# Altium schematic sheet STM32_IO.SchDoc: STM32 IO
size A3; CompanyName: Green Team Twente; Organization: Green Team Twente; Revision: V1.1; SheetNumber: 4; SheetTotal: 10; Team: 2024; Subsystem: Embedded Systems
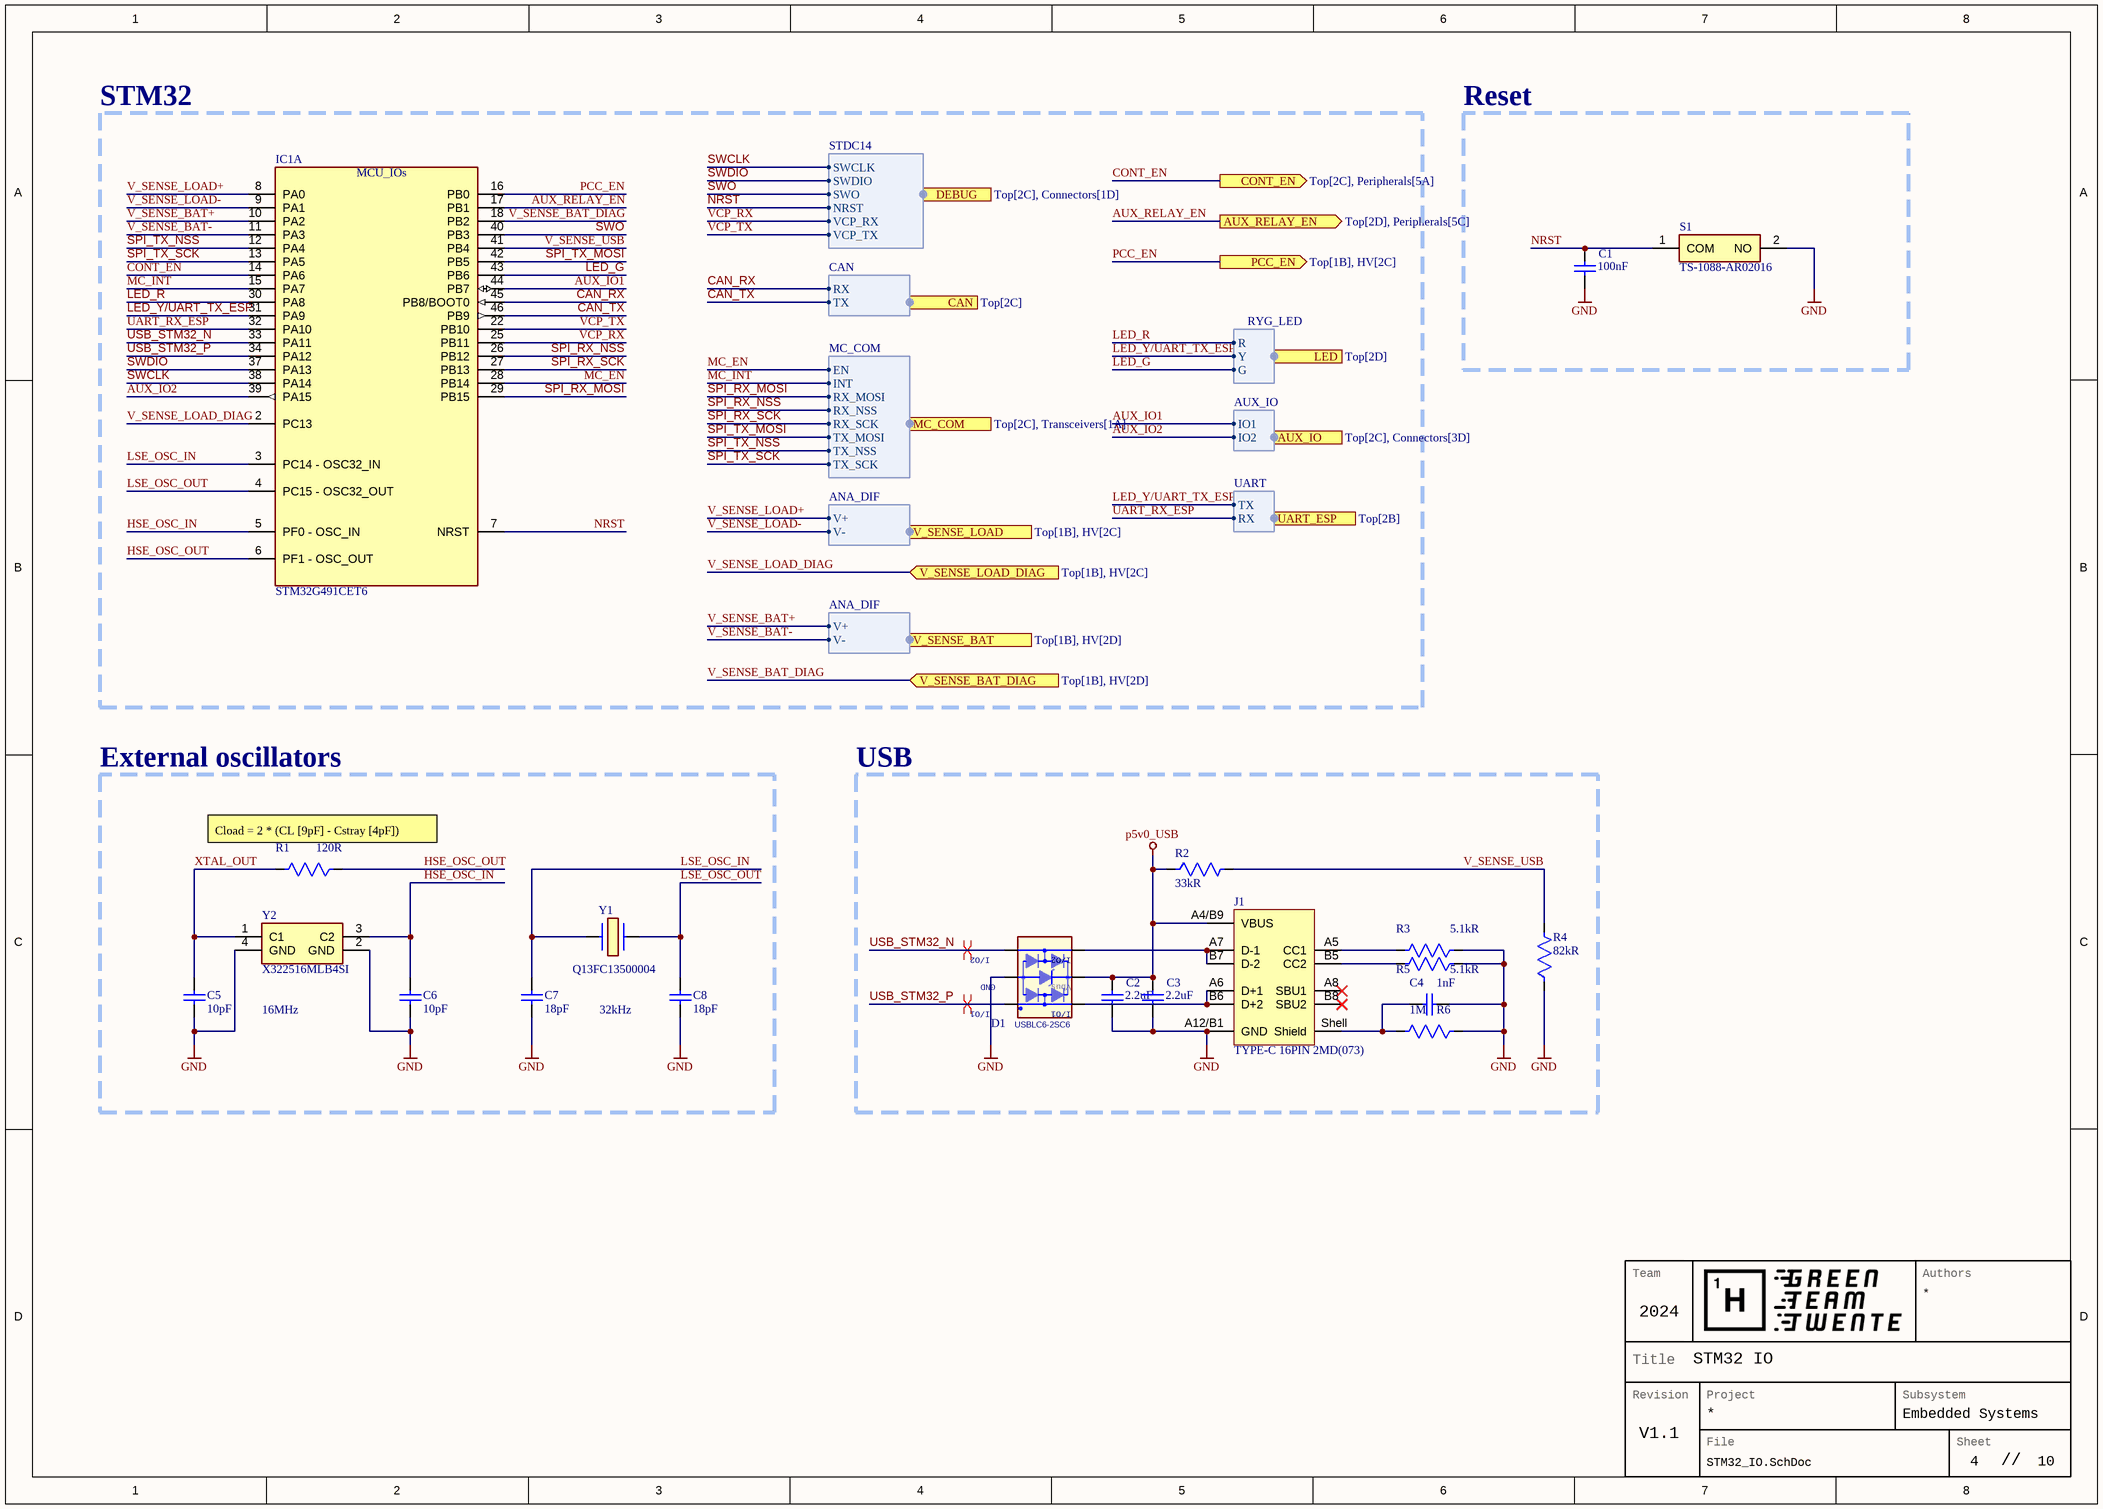
[diagram p0: STM32_IO.SchDoc]

## Parts
C1  value 100nF  [WCAP-CSGP_0402_L1W0.5H0.5]  (hidden comment: CAP 0402 100nF X7R)
C2  value 2.2uF  [WCAP-CSGP_0603_L1.6W0.8H0.8_Reflow]  (hidden comment: CAP 0603 2.2uF X7R)
C3  value 2.2uF  [WCAP-CSGP_0603_L1.6W0.8H0.8_Reflow]  (hidden comment: CAP 0603 2.2uF X7R)
C4  value 1nF  [WCAP-CSGP_1206_L3.2W1.6H1.15]  (hidden comment: CAP 1206 1nF X7R)
C5  value 10pF  [WCAP-CSGP_0402_L1W0.5H0.5]  (hidden comment: CAP 0402 10pF X7R)
C6  value 10pF  [WCAP-CSGP_0402_L1W0.5H0.5]  (hidden comment: CAP 0402 10pF X7R)
C7  value 18pF  [WCAP-CSGP_0402_L1W0.5H0.5]  (hidden comment: CAP 0402 18pF X7R)
C8  value 18pF  [WCAP-CSGP_0402_L1W0.5H0.5]  (hidden comment: CAP 0402 18pF X7R)
D1  USBLC6-2SC6  [ST_SOT23-6L]
IC1  STM32G491CET6  [QFP50P900X900X160-48N]  (part A of 2)
J1  TYPE-C 16PIN 2MD(073)  [629722000214]
R1  value 120R  [FP0402]  (hidden comment: RES 0402 120R 1%)
R2  value 33kR  [FP0402]  (hidden comment: RES 0402 33kR 1%)
R3  value 5.1kR  [FP0402]  (hidden comment: RES 0402 5.1kR 1%)
R4  value 82kR  [RES_SM0603_YAGEORC_N]  (hidden comment: RES 0603 82kR 1%)
R5  value 5.1kR  [FP0402]  (hidden comment: RES 0402 5.1kR 1%)
R6  value 1M  [RES_SM1206_YAGEORC_N]  (hidden comment: RES 1206 1M 1%)
S1  TS-1088-AR02016  [TS1088AR02016]
Y1  Q13FC13500004  [Q13FC1350000400]
Y2  X322516MLB4SI  [X322516MLB4SI]

## Blocks framed on the sheet
STM32: IC1
Reset: C1 S1
External oscillators: C5-C8 R1 Y1 Y2
USB: C2-C4 D1 J1 R2-R6

## Ports
AUX_IO (out, harness AUX_IO, see Top[2C], Connectors[3D]), AUX_RELAY_EN (out, see Top[2D], Peripherals[5C]), CAN (harness CAN, see Top[2C]), CONT_EN (out, see Top[2C], Peripherals[5A]), DEBUG (harness STDC14, see Top[2C], Connectors[1D]), LED (harness RYG_LED, see Top[2D]), MC_COM (out, harness MC_COM, see Top[2C], Transceivers[1A]), PCC_EN (out, see Top[1B], HV[2C]), UART_ESP (out, harness UART, see Top[2B]), V_SENSE_BAT (out, harness ANA_DIF, see Top[1B], HV[2D]), V_SENSE_BAT_DIAG (in, see Top[1B], HV[2D]), V_SENSE_LOAD (out, harness ANA_DIF, see Top[1B], HV[2C]), V_SENSE_LOAD_DIAG (in, see Top[1B], HV[2C])

## Harnesses
MC_COM: EN, INT, RX_MOSI, RX_NSS, RX_SCK, TX_MOSI, TX_NSS, TX_SCK
CAN: RX, TX
RYG_LED: G, R, Y
ANA_DIF: V+, V-
AUX_IO: IO1, IO2
STDC14: SWDIO, SWCLK, NRST, SWO, VCP_RX, VCP_TX
UART: TX, RX

## Nets
GND: C1.1 C2.1 C3.1 C4.2 C5.1 C6.1 C7.1 C8.1 D1.2(GND) J1.A12/B1(GND) R3.1 R4.1 R5.1 R6.1 S1.2(NO) Y2.2(GND) Y2.4(GND)
p5v0_USB: C2.2 C3.2 D1.5(Vbus) J1.A4/B9(VBUS) R2.1
AUX_IO1: IC1.44(PB7) ; port AUX_IO.IO1
AUX_IO2: IC1.39(PA15) ; port AUX_IO.IO2
AUX_RELAY_EN: IC1.17(PB1) ; port AUX_RELAY_EN
CAN_RX: IC1.45(PB8/BOOT0) ; port CAN.RX
CAN_TX: IC1.46(PB9) ; port CAN.TX
CONT_EN: IC1.14(PA6) ; port CONT_EN
HSE_OSC_IN: C6.2 IC1.5(PF0_-_OSC_IN) Y2.3(C2)
HSE_OSC_OUT: IC1.6(PF1_-_OSC_OUT) R1.1
LED_G: IC1.43(PB6) ; port LED.G
LED_R: IC1.30(PA8) ; port LED.R
LED_Y/UART_TX_ESP: IC1.31(PA9) ; port LED.Y, port UART_ESP.TX
LSE_OSC_IN: C7.2 IC1.3(PC14_-_OSC32_IN) Y1.2(CRYSTAL_2)
LSE_OSC_OUT: C8.2 IC1.4(PC15_-_OSC32_OUT) Y1.1(CRYSTAL_1)
MC_EN: IC1.28(PB14) ; port MC_COM.EN
MC_INT: IC1.15(PA7) ; port MC_COM.INT
NRST: C1.2 IC1.7(NRST) S1.1(COM) ; port DEBUG.NRST
PCC_EN: IC1.16(PB0) ; port PCC_EN
SPI_RX_MOSI: IC1.29(PB15) ; port MC_COM.RX_MOSI
SPI_RX_NSS: IC1.26(PB12) ; port MC_COM.RX_NSS
SPI_RX_SCK: IC1.27(PB13) ; port MC_COM.RX_SCK
SPI_TX_MOSI: IC1.42(PB5) ; port MC_COM.TX_MOSI
SPI_TX_NSS: IC1.12(PA4) ; port MC_COM.TX_NSS
SPI_TX_SCK: IC1.13(PA5) ; port MC_COM.TX_SCK
SWCLK: IC1.38(PA14) ; port DEBUG.SWCLK
SWDIO: IC1.37(PA13) ; port DEBUG.SWDIO
SWO: IC1.40(PB3) ; port DEBUG.SWO
UART_RX_ESP: IC1.32(PA10) ; port UART_ESP.RX
USB_STM32_N: D1.3(I/O2) IC1.33(PA11)
USB_STM32_P: D1.1(I/O1) IC1.34(PA12)
V_SENSE_BAT+: IC1.10(PA2) ; port V_SENSE_BAT.V+
V_SENSE_BAT-: IC1.11(PA3) ; port V_SENSE_BAT.V-
V_SENSE_BAT_DIAG: IC1.18(PB2) ; port V_SENSE_BAT_DIAG
V_SENSE_LOAD+: IC1.8(PA0) ; port V_SENSE_LOAD.V+
V_SENSE_LOAD-: IC1.9(PA1) ; port V_SENSE_LOAD.V-
V_SENSE_LOAD_DIAG: IC1.2(PC13) ; port V_SENSE_LOAD_DIAG
V_SENSE_USB: IC1.41(PB4) R2.2 R4.2
VCP_RX: IC1.25(PB11) ; port DEBUG.VCP_RX
VCP_TX: IC1.22(PB10) ; port DEBUG.VCP_TX
XTAL_OUT: C5.2 R1.2 Y2.1(C1)
NetC4_1: C4.1 J1.Shell(Shield) R6.2
NetD1_4: D1.4(I/O2+) J1.A7(D-1) J1.B7(D-2)
NetD1_6: D1.6(I/O1+) J1.A6(D+1) J1.B6(D+2)
NetJ1_A5: J1.A5(CC1) R3.2
NetJ1_B5: J1.B5(CC2) R5.2

Not connected (* = marked no-connect by the designer): J1 A8(SBU1)* B8(SBU2)*

## Layout directives
differential pair; differential pair class USB90; rule Clearance Constraint [Generic clearance = 0.15mm, and 12 value(s) for objects]: USB_STM32_N, USB_STM32_P

## Notes on the sheet
- (near R1) Cload = 2 * (CL [9pF] - Cstray [4pF])
- 16MHz
- 32kHz
- Team
- Authors
- Revision
- Title
- Project
- Subsystem
- File
- Sheet
- //
- (in symbol CMP-031-00032-4, part A) MCU_IOs

## Library data of the parts
C1 C5-C8 = CMP-001-01308-5: GTT Standard 0402 non-polarized capacitor; Pins: 2; Case/Package: 0402; Category: Multilayer Ceramic Chip Capacitors; Ceramic Type: X7R
  C1: JLCPCB Part #: C1525
  C5 C6: JLCPCB Part #: C32949
  C7 C8: JLCPCB Part #: C1549
C2 C3 = CMP-001-01309-1: GTT Standard 0603 non-polarized capacitor; Case/Package: 0603; Category: Multilayer Ceramic Chip Capacitors; Ceramic Type: X7R; Pins: 2; JLCPCB Part #: C23630
C4 = CMP-001-01311-1: GTT Standard 1206 non-polarized capacitor; Voltage Rating: 2kV; Case/Package: 1206; Ceramic Type: X7R; Category: Multilayer Ceramic Chip Capacitors; Pins: 2; JLCPCB Part #: C9196
D1 = CMP-004-00059-1: Design Item ID: USBLC6-2SC6; Source: USBLC6-2SC6.SchLib
IC1 = CMP-031-00032-4: ARM Microcontrollers - MCU Mainstream Arm Cortex-M4+ MCU 170MHz with 512Kbytes of Flash memory; Manufacturer_Name: STMicroelectronics; Arrow Part Number: STM32G491CET6; Source: TempSchematics.schlib; Mouser Part Number: 511-STM32G491CET6; Datasheet Link: https://cz.mouser.com/datasheet/2/389/dm00654712-2042072.pdf; Manufacturer_Part_Number: STM32G491CET6; Design Item ID: STM32G491CET6; Mouser Price/Stock: https://www.mouser.co.uk/ProductDetail/STMicroelectronics/STM32G491CET6?qs=eP2BKZSCXI5LxAF%2FNuF5Tg%3D%3D; Arrow Price/Stock: https://www.arrow.com/en/products/stm32g491cet6/stmicroelectronics?region=nac; Height: 1.6mm
J1 = CMP-002-000088-9: WR-USB 2.0 Type C, Receptacle, Horizontal, SMT; pin to pad: A4/B9>A4/B9+A9/B4 A12/B1>A12/B1+A1/B12; Manufacturer: Wurth Elektronik; Number of Ports: 1; Interface Type: Type C; Working Voltage: 20VAC; Rated Current: 5A; ComponentLink1URL: https://www.we-online.com/redexpert/article/629722000214?ad; Number of Pins: 16; ComponentLink2Description: Datasheet Link; Component Type: Standard; Mount: Surface Mount; Manufacturer Part Number: 629722000214; Orientation: Horizontal; Design Item ID: 629722000214; Operating Temperature Max: 85°C; Packaging: Tape and Reel; Operating Temperature Min: -40°C; ComponentLink2URL: https://www.we-online.com/redexpert/spec/629722000214?ad; Pin Count: 13; Source: WR-USB.SchLib; Gender: Receptacle; Application: USB 2.0; Match Code: WR-USB; ComponentLink1Description: Website Link; Category: Input/Output Connectors
R1-R3 R5 = CMP-009-00204-17: GTT Standard 0402 Resistor; Voltage Rating: 50V; Power: 62.5mW; Mounting Technology: SMD; Tolerance: 1%; Case/Package: 0402; Design Item ID: RES 0402; Source: Passives.SchLib
  R1: JLCPCB Part #: C25079
  R2: JLCPCB Part #: C25779
  R3 R5: JLCPCB Part #: C25905
R4 = CMP-009-00206-3: GTT Standard 0603 Resistor; Voltage Rating: 50V; Power: 62.5mW; Case/Package: 0603; Tolerance: 1%; Mounting Technology: SMD; JLCPCB Part #: C23254
R6 = CMP-009-00208-3: GTT Standard 1206 Resistor; Voltage Rating: 50V; Power: 62.5mW; Tolerance: 1%; Case/Package: 1206; Mounting Technology: SMD; JLCPCB Part #: C17927
S1 = TS-1088-AR02016: Switch; Manufacturer_Name: XUNPU; Datasheet Link: https://www.xunpudianzi.com/uploads/pdf/TS-1088-ARXXX.pdf; Height: 2mm; Manufacturer_Part_Number: TS-1088-AR02016
Y1 = Q13FC13500004: Crystal or Oscillator; Manufacturer_Name: Seiko Epson Corporation; Datasheet Link: https://datasheet.lcsc.com/szlcsc/1901081604_Seiko-Epson-Q13FC1350000400_C32346.pdf; Height: 0.9mm; Manufacturer_Part_Number: Q13FC1350000400
Y2 = X322516MLB4SI: Crystal or Oscillator; Manufacturer_Name: Yangxing Tech; Datasheet Link: https://datasheet.lcsc.com/szlcsc/Yangxing-Tech-X322516MLB4SI_C13738.pdf; Height: 0.8mm; Manufacturer_Part_Number: X322516MLB4SI